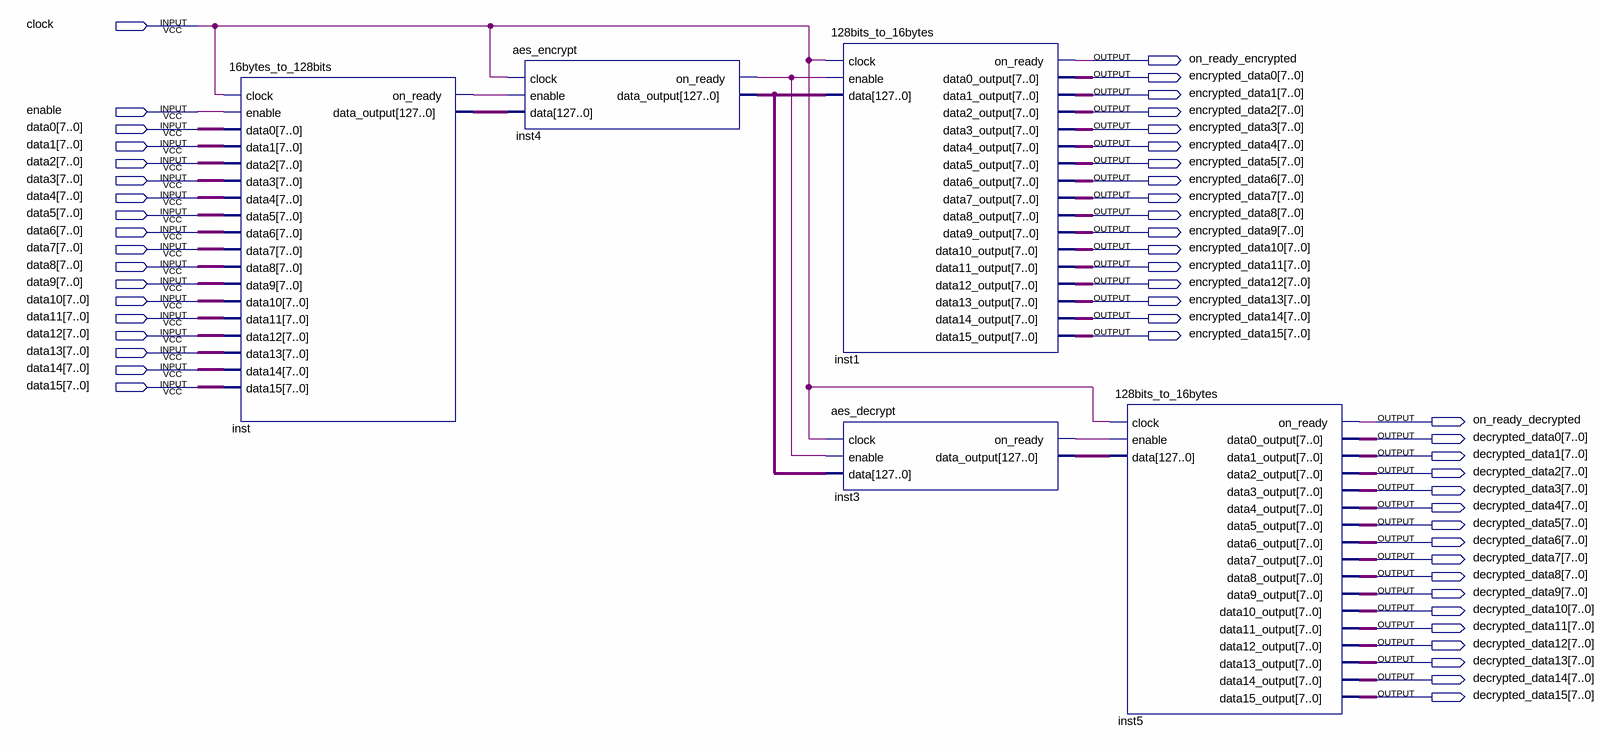
[diagram p0: schematic sheet]
// Quartus schematic aes_quartus2.bdf as structural Verilog: 5 symbols, 52 pins
module aes_quartus2 (
  input  clock,
  input  enable,
  input  [7:0] data0,
  input  [7:0] data1,
  input  [7:0] data2,
  input  [7:0] data3,
  input  [7:0] data4,
  input  [7:0] data5,
  input  [7:0] data6,
  input  [7:0] data7,
  input  [7:0] data8,
  input  [7:0] data9,
  input  [7:0] data10,
  input  [7:0] data11,
  input  [7:0] data12,
  input  [7:0] data13,
  input  [7:0] data14,
  input  [7:0] data15,
  output on_ready_encrypted,
  output [7:0] encrypted_data0,
  output [7:0] encrypted_data1,
  output [7:0] encrypted_data2,
  output [7:0] encrypted_data3,
  output [7:0] encrypted_data4,
  output [7:0] encrypted_data5,
  output [7:0] encrypted_data6,
  output [7:0] encrypted_data7,
  output [7:0] encrypted_data8,
  output [7:0] encrypted_data9,
  output [7:0] encrypted_data10,
  output [7:0] encrypted_data11,
  output [7:0] encrypted_data12,
  output [7:0] encrypted_data13,
  output [7:0] encrypted_data14,
  output [7:0] encrypted_data15,
  output on_ready_decrypted,
  output [7:0] decrypted_data0,
  output [7:0] decrypted_data1,
  output [7:0] decrypted_data2,
  output [7:0] decrypted_data3,
  output [7:0] decrypted_data4,
  output [7:0] decrypted_data5,
  output [7:0] decrypted_data6,
  output [7:0] decrypted_data7,
  output [7:0] decrypted_data8,
  output [7:0] decrypted_data9,
  output [7:0] decrypted_data10,
  output [7:0] decrypted_data11,
  output [7:0] decrypted_data12,
  output [7:0] decrypted_data13,
  output [7:0] decrypted_data14,
  output [7:0] decrypted_data15
);

  wire inst3_on_ready, inst4_on_ready, inst_on_ready;
  wire [127:0] inst3_data_output, inst4_data_output, inst_data_output;

  \16bytes_to_128bits  inst (
    .clock(clock), .enable(enable), .data0(data0), .data1(data1), .data2(data2), .data3(data3),
    .data4(data4), .data5(data5), .data6(data6), .data7(data7), .data8(data8), .data9(data9),
    .data10(data10), .data11(data11), .data12(data12), .data13(data13), .data14(data14), .data15(data15),
    .on_ready(inst_on_ready), .data_output(inst_data_output));
  aes_encrypt inst4 (
    .clock(clock), .enable(inst_on_ready), .data(inst_data_output), .on_ready(inst4_on_ready),
    .data_output(inst4_data_output));
  \128bits_to_16bytes  inst1 (
    .clock(clock), .enable(inst4_on_ready), .data(inst4_data_output), .on_ready(on_ready_encrypted),
    .data0_output(encrypted_data0), .data1_output(encrypted_data1), .data2_output(encrypted_data2),
    .data3_output(encrypted_data3), .data4_output(encrypted_data4), .data5_output(encrypted_data5),
    .data6_output(encrypted_data6), .data7_output(encrypted_data7), .data8_output(encrypted_data8),
    .data9_output(encrypted_data9), .data10_output(encrypted_data10), .data11_output(encrypted_data11),
    .data12_output(encrypted_data12), .data13_output(encrypted_data13), .data14_output(encrypted_data14),
    .data15_output(encrypted_data15));
  aes_decrypt inst3 (
    .clock(clock), .enable(inst4_on_ready), .data(inst4_data_output), .on_ready(inst3_on_ready),
    .data_output(inst3_data_output));
  \128bits_to_16bytes  inst5 (
    .clock(clock), .enable(inst3_on_ready), .data(inst3_data_output), .on_ready(on_ready_decrypted),
    .data0_output(decrypted_data0), .data1_output(decrypted_data1), .data2_output(decrypted_data2),
    .data3_output(decrypted_data3), .data4_output(decrypted_data4), .data5_output(decrypted_data5),
    .data6_output(decrypted_data6), .data7_output(decrypted_data7), .data8_output(decrypted_data8),
    .data9_output(decrypted_data9), .data10_output(decrypted_data10), .data11_output(decrypted_data11),
    .data12_output(decrypted_data12), .data13_output(decrypted_data13), .data14_output(decrypted_data14),
    .data15_output(decrypted_data15));
endmodule
